# Altium schematic sheet OMD_DRIVER_42V.SchDoc
size A3; Organization: Altium Limited; Address1: L3, 12a Rodborough Rd; Address2: Frenchs Forest; Address3: NSW; Address4: Australia 2086
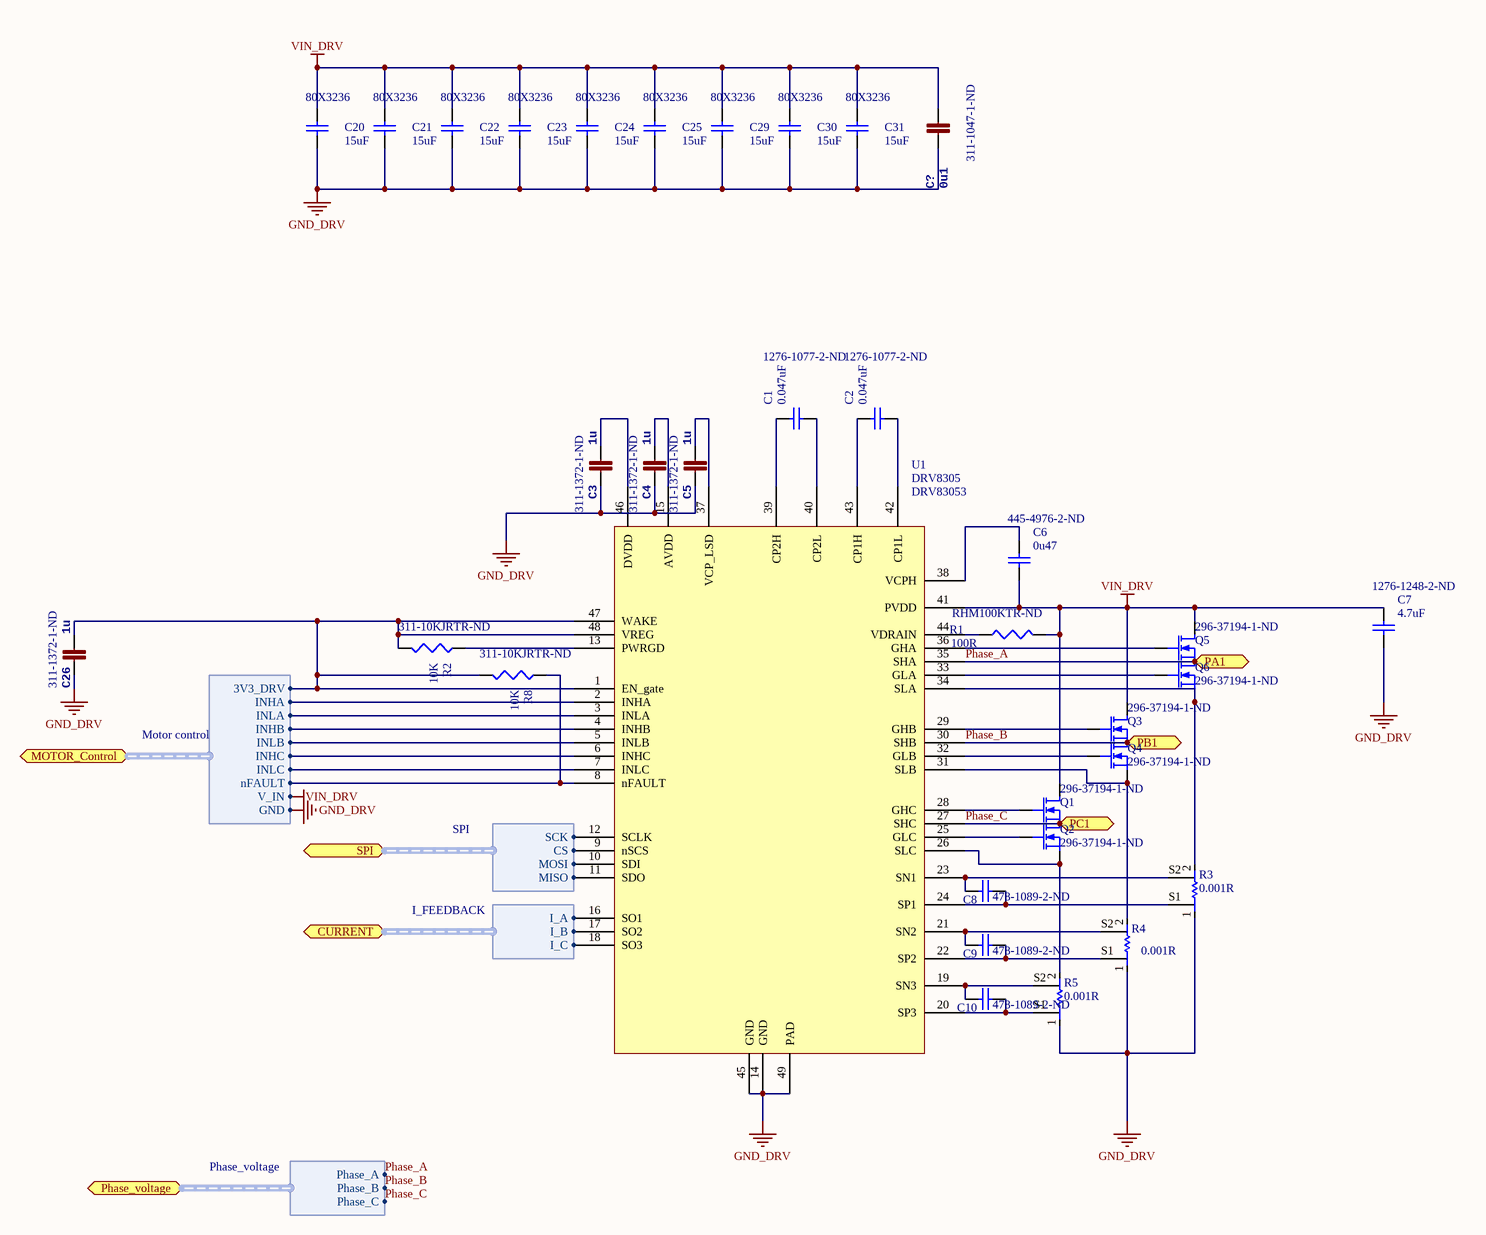
[diagram p0: OMD_DRIVER_42V.SchDoc]

## Parts
C1  value 0.047uF  Supplier Part Number 1: 1276-1077-2-ND  [C0402]  (hidden comment: 0.047uF ceramic cap 16V)
C2  value 0.047uF  Supplier Part Number 1: 1276-1077-2-ND  [C0402]  (hidden comment: Capacitor)
C3  1u  Supplier Part Number 1: 311-1372-1-ND  [0603-CAP]
C4  1u  Supplier Part Number 1: 311-1372-1-ND  [0603-CAP]
C5  1u  Supplier Part Number 1: 311-1372-1-ND  [0603-CAP]
C6  value 0u47  Supplier Part Number 1: 445-4976-2-ND  [C0402]  (hidden comment: CAP CER 0.47UF 16V X5R 0402)
C7  value 4.7uF  Supplier Part Number 1: 1276-1248-2-ND  [C0805]  (hidden comment: Capacitor)
C8  Supplier Part Number 1: 478-1089-2-ND  [C0402]  (hidden comment: CAP CER 100pf 0402)
C9  Supplier Part Number 1: 478-1089-2-ND  [C0402]  (hidden comment: CAP CER 100pf 0402)
C10  Supplier Part Number 1: 478-1089-2-ND  [C0402]  (hidden comment: CAP CER 100pf 0402)
C20  value 15uF  Supplier Part Number 1: 80X3236  [CAPC5750L]  (hidden comment: Cap)
C21  value 15uF  Supplier Part Number 1: 80X3236  [CAPC5750L]  (hidden comment: Cap)
C22  value 15uF  Supplier Part Number 1: 80X3236  [CAPC5750L]  (hidden comment: Cap)
C23  value 15uF  Supplier Part Number 1: 80X3236  [CAPC5750L]  (hidden comment: Cap)
C24  value 15uF  Supplier Part Number 1: 80X3236  [CAPC5750L]  (hidden comment: Cap)
C25  value 15uF  Supplier Part Number 1: 80X3236  [CAPC5750L]  (hidden comment: Cap)
C26  1u  Supplier Part Number 1: 311-1372-1-ND  [0603-CAP]
C29  value 15uF  Supplier Part Number 1: 80X3236  [CAPC5750L]  (hidden comment: Cap)
C30  value 15uF  Supplier Part Number 1: 80X3236  [CAPC5750L]  (hidden comment: Cap)
C31  value 15uF  Supplier Part Number 1: 80X3236  [CAPC5750L]  (hidden comment: Cap)
C?  0u1  Supplier Part Number 1: 311-1047-1-ND  [0402-CAP]
Q1  Supplier Part Number 1: 296-37194-1-ND  [Q5B]  (hidden comment: MOSFET-N)
Q2  Supplier Part Number 1: 296-37194-1-ND  [Q5B]  (hidden comment: MOSFET-N)
Q3  Supplier Part Number 1: 296-37194-1-ND  [Q5B]  (hidden comment: MOSFET-N)
Q4  Supplier Part Number 1: 296-37194-1-ND  [Q5B]  (hidden comment: MOSFET-N)
Q5  Supplier Part Number 1: 296-37194-1-ND  [Q5B]  (hidden comment: MOSFET-N)
Q6  Supplier Part Number 1: 296-37194-1-ND  [Q5B]  (hidden comment: MOSFET-N)
R1  value 100R  Supplier Part Number 1: RHM100KTR-ND  [R0805]  (hidden comment: Resistor)
R2  value 10K  Supplier Part Number 1: 311-10KJRTR-ND  [R0402]  (hidden comment: RES SMD 10K OHM 5% 1/16W 0402)
R3  value 0.001R  [4RESC5125X09N]  (hidden comment: Current sense resistor)
R4  value 0.001R  [4RESC5125X09N]  (hidden comment: Current sense resistor)
R5  value 0.001R  [4RESC5125X09N]  (hidden comment: Current sense resistor)
R8  value 10K  Supplier Part Number 1: 311-10KJRTR-ND  [R0402]  (hidden comment: RES SMD 10K OHM 5% 1/16W 0402)
U1  DRV8305  Supplier Part Number 1: DRV83053  [PQFP-G48]

## Ports
CURRENT (harness I_FEEDBACK), MOTOR_Control (harness Motor control), PA1, PB1, PC1, Phase_voltage (harness Phase_voltage), SPI (harness SPI)

## Harnesses
SPI: SCK, MISO, MOSI, CS
I_FEEDBACK: I_A, I_B, I_C
Motor control: 3V3_DRV, INHA, INLA, INHB, INLB, INHC, INLC, nFAULT, V_IN, GND
Phase_voltage: Phase_A, Phase_B, Phase_C

## Nets
GND_DRV: C3.P$2 C4.P$2 C5.P$2 C7.1 C20.1 C21.1 C22.1 C23.1 C24.1 C25.1 C26.P$2 C29.1 C30.1 C31.1 C?.P$2 R3.1 R4.1 R5.1 U1.14(GND) U1.45(GND) U1.49(PAD) ; port MOTOR_Control.GND
VIN_DRV: C6.1 C7.2 C20.2 C21.2 C22.2 C23.2 C24.2 C25.2 C29.2 C30.2 C31.2 C?.P$1 Q1.D Q3.D Q5.D R1.2 U1.41(PVDD) ; port MOTOR_Control.V_IN
Phase_A: Q5.S Q6.D U1.35(SHA) ; port PA1, port Phase_voltage.Phase_A
Phase_B: Q3.S Q4.D U1.30(SHB) ; port PB1, port Phase_voltage.Phase_B
Phase_C: Q1.S Q2.D U1.27(SHC) ; port PC1, port Phase_voltage.Phase_C
NetC1_1: C1.1 U1.40(CP2L)
NetC1_2: C1.2 U1.39(CP2H)
NetC2_1: C2.1 U1.42(CP1L)
NetC2_2: C2.2 U1.43(CP1H)
NetC3_P$1: C3.P$1 U1.46(DVDD)
NetC4_P$1: C4.P$1 U1.15(AVDD)
NetC5_P$1: C5.P$1 U1.37(VCP_LSD)
NetC6_2: C6.2 U1.38(VCPH)
NetC8_1: C8.1 R3.S1 U1.24(SP1)
NetC8_2: C8.2 R3.S2 U1.23(SN1)
NetC9_1: C9.1 R4.S1 U1.22(SP2)
NetC9_2: C9.2 R4.S2 U1.21(SN2)
NetC10_1: C10.1 R5.S1 U1.20(SP3)
NetC10_2: C10.2 R5.S2 U1.19(SN3)
NetC26_P$1: C26.P$1 R2.2 R8.2 U1.1(EN_gate) U1.47(WAKE) U1.48(VREG) ; port MOTOR_Control.3V3_DRV
NetQ1_G: Q1.G U1.28(GHC)
NetQ2_G: Q2.G U1.25(GLC)
NetQ2_S: Q2.S R5.2 U1.26(SLC)
NetQ3_G: Q3.G U1.29(GHB)
NetQ4_G: Q4.G U1.32(GLB)
NetQ4_S: Q4.S R4.2 U1.31(SLB)
NetQ5_G: Q5.G U1.36(GHA)
NetQ6_G: Q6.G U1.33(GLA)
NetQ6_S: Q6.S R3.2 U1.34(SLA)
NetR1_1: R1.1 U1.44(VDRAIN)
NetR2_1: R2.1 U1.13(PWRGD)
NetR8_1: R8.1 U1.8(nFAULT) ; port MOTOR_Control.nFAULT
NetU1_2: U1.2(INHA) ; port MOTOR_Control.INHA
NetU1_3: U1.3(INLA) ; port MOTOR_Control.INLA
NetU1_4: U1.4(INHB) ; port MOTOR_Control.INHB
NetU1_5: U1.5(INLB) ; port MOTOR_Control.INLB
NetU1_6: U1.6(INHC) ; port MOTOR_Control.INHC
NetU1_7: U1.7(INLC) ; port MOTOR_Control.INLC
NetU1_9: U1.9(nSCS) ; port SPI.CS
NetU1_10: U1.10(SDI) ; port SPI.MOSI
NetU1_11: U1.11(SDO) ; port SPI.MISO
NetU1_12: U1.12(SCLK) ; port SPI.SCK
NetU1_16: U1.16(SO1) ; port CURRENT.I_A
NetU1_17: U1.17(SO2) ; port CURRENT.I_B
NetU1_18: U1.18(SO3) ; port CURRENT.I_C

## Notes on the sheet
- https://github.com/OpenMotorDrive
- https://creativecommons.org/licenses/by-nc-sa/4.0/
- Title
- Size:
- Date:
- A3
- Number:
- Time:
- Revision:
- Sheet
- of
- ProfiCNC Pty. Ltd.
- For Commercial use, please contact ProfiCNC
- ProfiCNC does NOT guaranty these drawings as fit for any purpose, you must verify this information before attempting to use it in any way.  USE AT OWN RISK
- File:

## Library data of the parts
C1 C6 C8-C10 = Capacitor: Supplier 1: Digi-Key
  C8-C10: Value: 100pf
C2 = Capacitor: 0.047uF ceramic cap 16V; Supplier 1: Digi-Key
C3-C5 C26 = CAP0603: CAP CER 1UF 16V Y5V 0603; Supplier 1: Digi-Key; Value: 1u
C20-C25 C29-C31 = Cap: Capacitor; Supplier 1: Newark
C? = CAP0402: CAP CER 0.1UF 16V Y5V 0402; Supplier 1: Digi-Key; Value: 0u1
Q1-Q6 = MOSFET-N: N-Channel MOSFET; Supplier 1: Digi-Key
R1 = Resistor: RES SMD 100 OHM 5% 0.4W 0805; Supplier 1: Digi-Key
R2 R8 = Resistor: Supplier 1: Digi-Key
R3-R5 = WSLP20101L000FEK: 2W, 0.001R 5025 current sense resistor; Supplier 1: Digi-Key; Supplier Part Number 1: CSNL2010FT1L00CT-ND
C7 = Capacitor: Supplier 1: Digi-Key
U1 = DRV8305: Supplier 1: TI